# EAGLE design RHD2132_HS-accel-JAE (EAGLE 9.1.0)
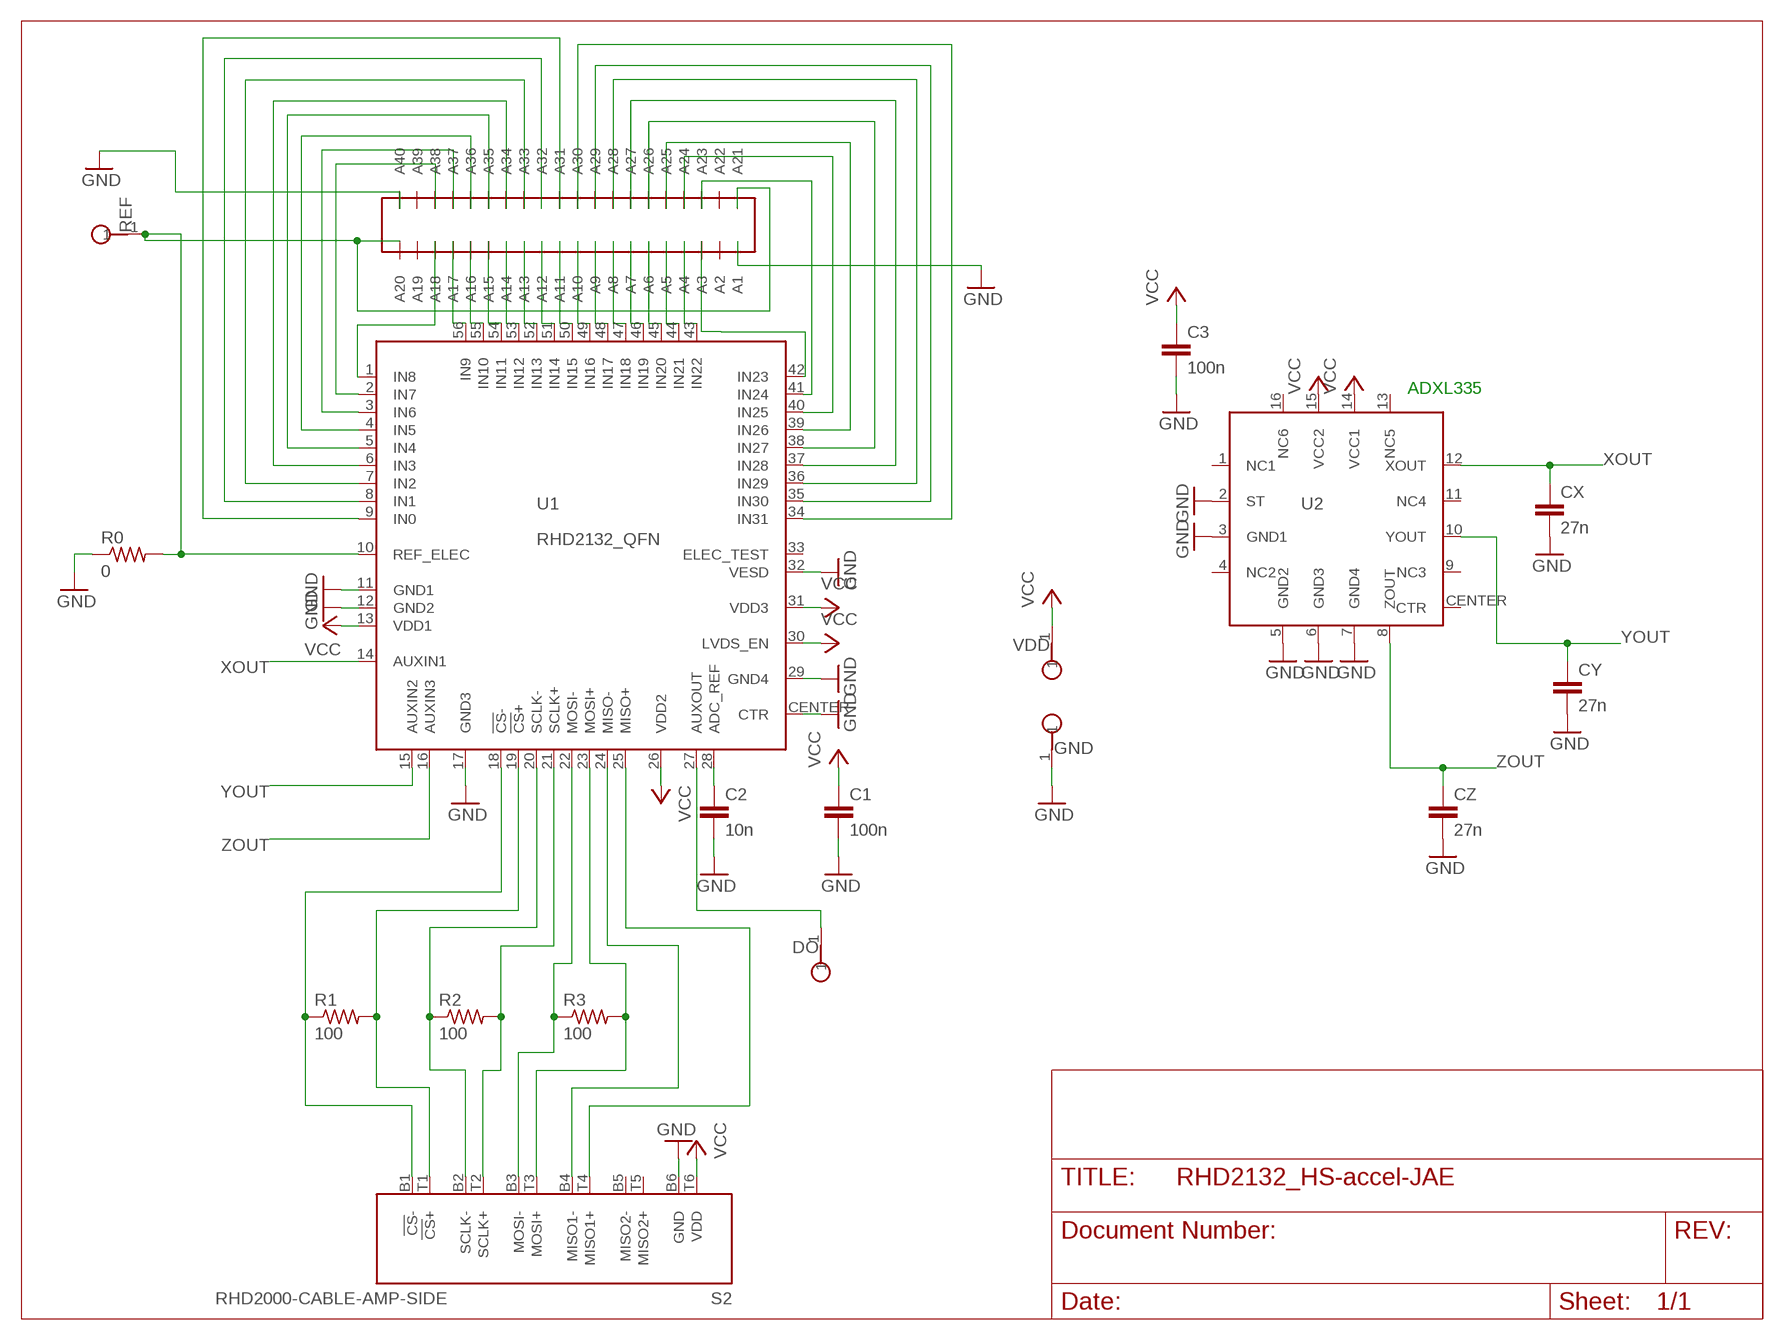
[diagram p0: schematic, sheet 1]

## Parts
C1  100n  C_0402  [0402]
C2  10n  C_0402  [0402]
C3  100n  C_0402  [0402]
CX  27n  C_0402  [0402]
CY  27n  C_0402  [0402]
CZ  27n  C_0402  [0402]
DO  TESTPOINT_SMALL  [TESTPOINT_SMALL]
GND  TESTPOINT_SMALL  [TESTPOINT_SMALL]
R0  0  R_0402  [0402]
R1  100  R_0402  [0402]
R2  100  R_0402  [0402]
R3  100  R_0402  [0402]
REF  TESTPOINT_SMALL  [TESTPOINT_SMALL]
S2  RHD2000-CABLE-AMP-SIDE  [OMNETICS_PZN-12-AA]
U1  RHD2132_QFN  [QFN56_8_X_8_LARGE]
U2  ADXL335  [ADXL335]
U$1  WR-40P-HFHD  [WR-40P-HFHD]
VDD  TESTPOINT_SMALL  [TESTPOINT_SMALL]

## Nets
GND: C1.2 C2.2 C3.2 CX.2 CY.2 CZ.2 GND.1 R0.1 S2.B6(GND) U1.11(GND1) U1.12(GND2) U1.17(GND3) U1.29(GND4) U1.32(VESD) U1.CENTER(CTR) U2.2(ST) U2.3(GND1) U2.5(GND2) U2.6(GND3) U2.7(GND4) U$1.P$1(A1) U$1.P$40(A40)
N$2: U1.3(IN6) U$1.P$37(A37)
N$3: U1.2(IN7) U$1.P$38(A38)
N$4: U1.4(IN5) U$1.P$36(A36)
N$5: U1.5(IN4) U$1.P$35(A35)
N$6: U1.6(IN3) U$1.P$34(A34)
N$7: U1.7(IN2) U$1.P$33(A33)
N$8: U1.8(IN1) U$1.P$32(A32)
N$9: U1.9(IN0) U$1.P$31(A31)
N$10: U1.34(IN31) U$1.P$30(A30)
N$11: R1.1 S2.B1(!CS!-) U1.18(!CS!-)
N$12: U1.41(IN24) U$1.P$23(A23)
N$13: U1.40(IN25) U$1.P$24(A24)
N$14: U1.39(IN26) U$1.P$25(A25)
N$15: U1.38(IN27) U$1.P$26(A26)
N$16: U1.37(IN28) U$1.P$27(A27)
N$17: U1.36(IN29) U$1.P$28(A28)
N$18: U1.35(IN30) U$1.P$29(A29)
N$19: U1.56(IN9) U$1.P$17(A17)
N$20: U1.55(IN10) U$1.P$16(A16)
N$21: U1.54(IN11) U$1.P$15(A15)
N$22: U1.53(IN12) U$1.P$14(A14)
N$23: U1.52(IN13) U$1.P$13(A13)
N$24: U1.51(IN14) U$1.P$12(A12)
N$25: U1.50(IN15) U$1.P$11(A11)
N$26: U1.49(IN16) U$1.P$10(A10)
N$27: U1.48(IN17) U$1.P$9(A9)
N$28: U1.47(IN18) U$1.P$8(A8)
N$29: U1.46(IN19) U$1.P$7(A7)
N$30: U1.45(IN20) U$1.P$6(A6)
N$31: U1.44(IN21) U$1.P$5(A5)
N$32: U1.43(IN22) U$1.P$4(A4)
N$33: U1.1(IN8) U$1.P$18(A18)
N$34: U1.42(IN23) U$1.P$3(A3)
N$35: R1.2 S2.T1(!CS!+) U1.19(!CS!+)
N$36: R2.1 S2.B2(SCLK-) U1.20(SCLK-)
N$37: R2.2 S2.T2(SCLK+) U1.21(SCLK+)
N$38: R3.1 S2.B3(MOSI-) U1.22(MOSI-)
N$39: R3.2 S2.T3(MOSI+) U1.23(MOSI+)
N$40: S2.B4(MISO1-) U1.24(MISO-)
N$41: S2.T4(MISO1+) U1.25(MISO+)
N$42: C2.1 U1.28(ADC_REF)
N$43: DO.1 U1.27(AUXOUT)
N$44: R0.2 REF.1 U1.10(REF_ELEC) U$1.P$20(A20)
VCC: C1.1 C3.1 S2.T6(VDD) U1.13(VDD1) U1.26(VDD2) U1.30(LVDS_EN) U1.31(VDD3) U2.14(VCC1) U2.15(VCC2) VDD.1
XOUT: CX.1 U1.14(AUXIN1) U2.12(XOUT)
YOUT: CY.1 U1.15(AUXIN2) U2.10(YOUT)
ZOUT: CZ.1 U1.16(AUXIN3) U2.8(ZOUT)
Unconnected: S2.B5(MISO2-) S2.T5(MISO2+) U1.33(ELEC_TEST) U2.1(NC1) U2.4(NC2) U2.9(NC3) U2.11(NC4) U2.13(NC5) U2.16(NC6) U2.CENTER(CTR) U$1.P$2(A2) U$1.P$19(A19) U$1.P$21(A21) U$1.P$22(A22) U$1.P$39(A39)

## Notes on the sheet
- ADXL335

## Library data of the parts
C1-C3 CX CY CZ = RHD2000_eval_board:C: Capacitor
DO GND REF VDD = RHD2000_eval_board:TESTPOINT: PCB Test Point
R0 R1-R3 = RHD2000_eval_board:R: Resistor
S2 = RHD2000:RHD2000-CABLE-AMP-SIDE
U1 = RHD2000:RHD2132
U2 = harrison:ADXL335
U$1 = EIBLibrary:WR-40P-HFHD

## Net classes
1 thick: width 1.016 mm
2 power: width 0.61 mm

## Board
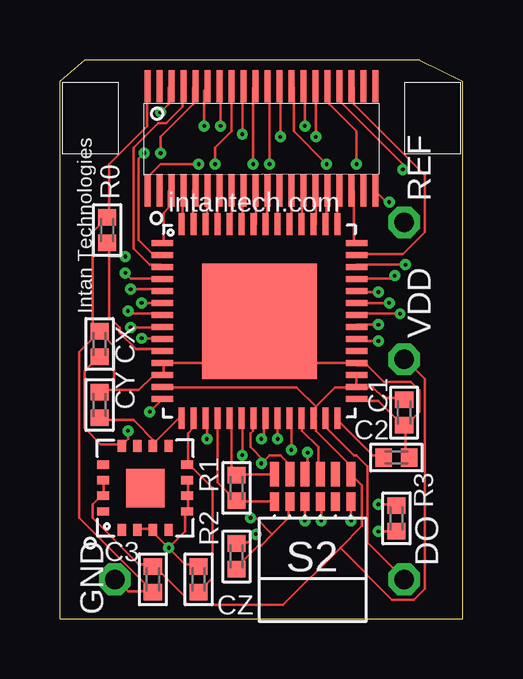
[diagram p1: board, top side]
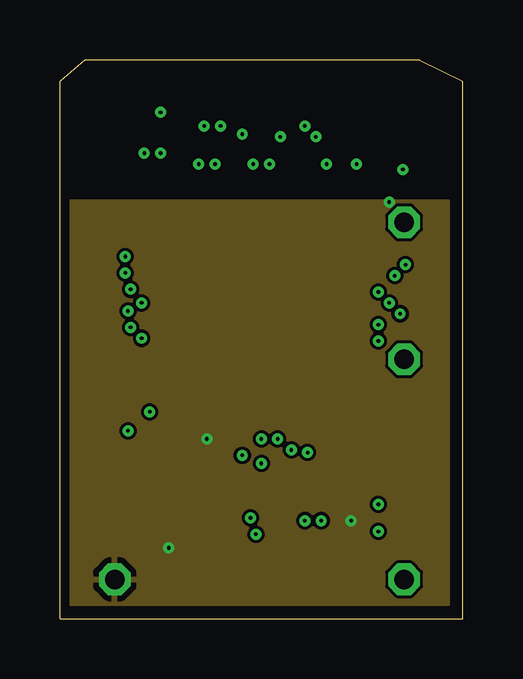
[diagram p2: board, inner layer Route2]
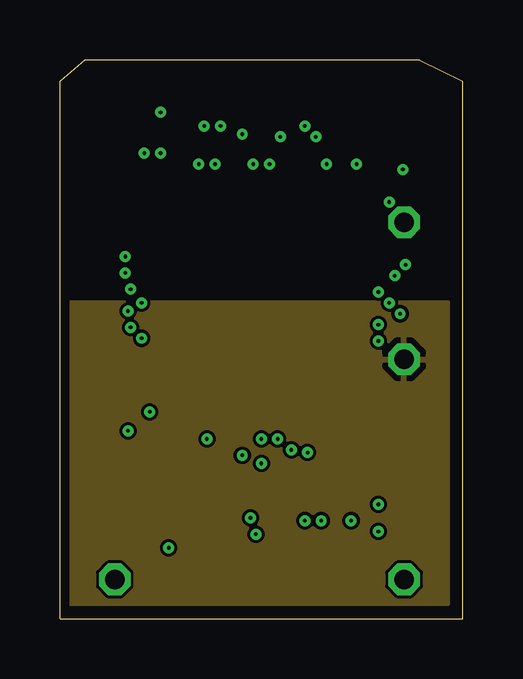
[diagram p3: board, inner layer Route15]
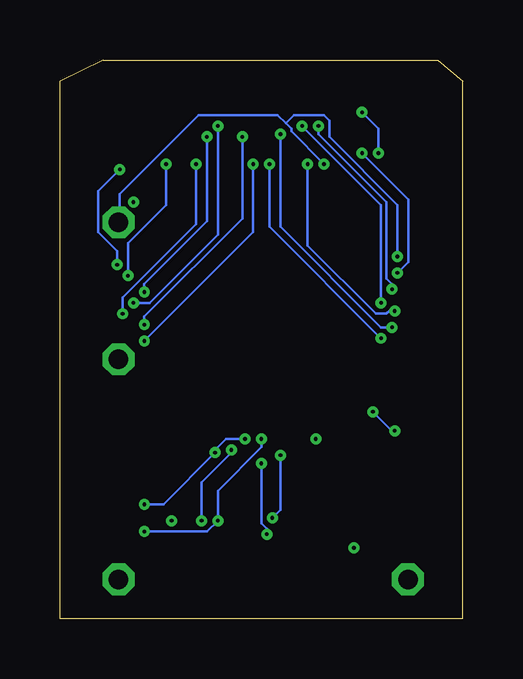
[diagram p4: board, bottom side, seen from below]

Size 16.8 x 23.3 mm. Coordinates in mm from the lower left corner, seen from the top.
Outline: 0,0 0,22.4 1.03,23.3 15.01,23.3 16.8,22.4 16.8,0 0,0
Copper layers (1*2+15*16): Top 0.035mm / dielectric 1.5mm / Route2 0.035mm / dielectric 0.15mm / Route15 0.035mm / dielectric 0.2mm / Bottom 0.035mm
Design rules "default *": minimum track width 0.1mm, minimum drill 6mil, track to track 5mil, track to pad 5mil, pad to pad 5mil, via to via 5mil, smd to smd 5mil, copper to edge 15mil, drill to drill 15mil, minimum pad ring 10mil, minimum via ring 6mil, stop-mask expansion 4mil, vias tented up to drill 0mil, thermal gap 10mil

### Footprints (pad centres in the part's own frame; a part is rotated, then mirrored left to right if it is on the bottom)
0402 = smd 0.686 x 0.762: 1 -0.533,0; 2 0.533,0
TESTPOINT_SMALL = drill 0.813 octagon: 1 0,0
OMNETICS_PZN-12-AA = smd 0.381 x 0.762: B1 1.587,-1.016; B2 0.953,-1.016; B3 0.318,-1.016; B4 -0.318,-1.016; B5 -0.953,-1.016; B6 -1.587,-1.016 | smd 0.381 x 1.016: T1 1.587,-2.159; T2 0.953,-2.159; T3 0.318,-2.159; T4 -0.318,-2.159; T5 -0.953,-2.159; T6 -1.587,-2.159
QFN56_8_X_8_LARGE = smd 0.9 x 0.25: 1 -4.05,3.25; 2 -4.05,2.75; 3 -4.05,2.25; 4 -4.05,1.75; 5 -4.05,1.25; 6 -4.05,0.75; 7 -4.05,0.25; 8 -4.05,-0.25; 9 -4.05,-0.75; 10 -4.05,-1.25; 11 -4.05,-1.75; 12 -4.05,-2.25; 13 -4.05,-2.75; 14 -4.05,-3.25; 29 4.05,-3.25; 30 4.05,-2.75; 31 4.05,-2.25; 32 4.05,-1.75; 33 4.05,-1.25; 34 4.05,-0.75; 35 4.05,-0.25; 36 4.05,0.25; 37 4.05,0.75; 38 4.05,1.25; 39 4.05,1.75; 40 4.05,2.25; 41 4.05,2.75; 42 4.05,3.25 | smd 0.25 x 0.9: 15 -3.25,-4.05; 16 -2.75,-4.05; 17 -2.25,-4.05; 18 -1.75,-4.05; 19 -1.25,-4.05; 20 -0.75,-4.05; 21 -0.25,-4.05; 22 0.25,-4.05; 23 0.75,-4.05; 24 1.25,-4.05; 25 1.75,-4.05; 26 2.25,-4.05; 27 2.75,-4.05; 28 3.25,-4.05; 43 3.25,4.05; 44 2.75,4.05; 45 2.25,4.05; 46 1.75,4.05; 47 1.25,4.05; 48 0.75,4.05; 49 0.25,4.05; 50 -0.25,4.05; 51 -0.75,4.05; 52 -1.25,4.05; 53 -1.75,4.05; 54 -2.25,4.05; 55 -2.75,4.05; 56 -3.25,4.05 | smd 4.8 x 4.8: CENTER 0,0
ADXL335 = smd 0.5 x 0.35: 1 -1.75,0.975; 2 -1.75,0.325; 3 -1.75,-0.325; 4 -1.75,-0.975; 9 1.75,-0.975; 10 1.75,-0.325; 11 1.75,0.325; 12 1.75,0.975 | smd 0.35 x 0.5: 5 -0.975,-1.75; 6 -0.325,-1.75; 7 0.325,-1.75; 8 0.975,-1.75; 13 0.975,1.75; 14 0.325,1.75; 15 -0.325,1.75; 16 -0.975,1.75 | smd 1.6 x 1.6: CENTER 0,0
WR-40P-HFHD = smd 0.25 x 1.35: P$1 0,0; P$2 0.5,0; P$3 1,0; P$4 1.5,0; P$5 2,0; P$6 2.5,0; P$7 3,0; P$8 3.5,0; P$9 4,0; P$10 4.5,0; P$11 5,0; P$12 5.5,0; P$13 6,0; P$14 6.5,0; P$15 7,0; P$16 7.5,0; P$17 8,0; P$18 8.5,0; P$19 9,0; P$20 9.5,0; P$21 0,-4.35; P$22 0.5,-4.35; P$23 1,-4.35; P$24 1.5,-4.35; P$25 2,-4.35; P$26 2.5,-4.35; P$27 3,-4.35; P$28 3.5,-4.35; P$29 4,-4.35; P$30 4.5,-4.35; P$31 5,-4.35; P$32 5.5,-4.35; P$33 6,-4.35; P$34 6.5,-4.35; P$35 7,-4.35; P$36 7.5,-4.35; P$37 8,-4.35; P$38 8.5,-4.35; P$39 9,-4.35; P$40 9.5,-4.35

### Placement (x,y rotation side)
C1  14.35,8.59 270 top
C2  14.04,6.72 0 top
C3  3.88,1.64 270 top
CX  1.65,11.45 90 top
CY  1.65,8.91 90 top
CZ  5.78,1.64 90 top
DO  14.35,1.64 0 top
GND  2.29,1.64 0 top
R0  1.97,16.2 270 top
R1  7.37,5.45 90 top
R2  7.37,2.59 90 top
R3  14.04,4.18 90 top
REF  14.35,16.53 90 top
S2  10.54,3.86 180 top
U1  8.32,12.4 0 top
U2  3.56,5.45 90 top
U$1  13.15,17.85 180 top
VDD  14.35,10.81 0 top

### Tracks (layer width: path | path; a pad name or v marks a point on that pad's centre or on a via)
GND  (via drill 0.15)
  Top 0.1: U2.7 5.33,5.67 5.33,5.22 U2.6 5.33,5.11 5.33,4.54 U2.5 5.22,4.43 5.22,3.63 v4.54,2.95 | U2.2 3.29,3.75 3.86,3.75 U2.3 3.97,3.63 3.97,3.52 v4.54,2.95 | v4.54,2.95 5.22,2.27 5.67,2.27 CZ.2 | 3.86,1.14 2.84,1.14 2.38,1.59 GND.1 | 3.86,1.14 C3.2 3.86,1.14 | v12.14,4.09 12.14,4.77 S2.B6 | v6.13,7.49 6.13,8.29 U1.17 | v13.73,17.37 13.62,17.37 13.17,17.82 U$1.P$1 | 2.27,9.53 3.29,9.53 3.86,10.1 4.2,10.1 U1.12 4.31,10.21 4.31,10.56 U1.11 4.31,10.67 6.58,10.67 8.29,12.37 U1.CENTER 8.4,12.37 10.1,10.67 12.26,10.67 U1.32 12.37,10.56 12.82,10.56 13.51,9.87 14.64,9.87 14.98,9.53 14.98,8.63 14.41,8.06 C1.2 | 2.27,9.53 1.7,9.53 CY.2 | 2.27,9.53 2.27,11.35 1.7,11.92 CX.2 | CX.2 1.59,12.03 1.36,12.26 1.36,16.12 1.93,16.68 R0.1 2.04,16.8 2.04,18.95 3.63,20.54 3.63,22.13 U$1.P$40 | C1.2 14.41,7.95 14.41,6.92 14.53,6.81 C2.2 | U1.29 12.37,9.08 13.28,9.08 14.3,8.06 C1.2 | 3.86,1.14 0.79,4.2 0.79,11.12 1.59,11.92 CX.2
  pour Route2: 0.4,0.6 16.2,0.6 16.2,17.4 0.4,17.4 0.4,12.4
N$2
  Top 0.1: U1.3 4.2,14.76 3.75,14.76 3.06,15.44 3.06,19.64 4.09,20.66 4.43,20.66 5.11,21.34 5.11,22.13 U$1.P$37
N$3  (via drill 0.15)
  Top 0.1: v3.52,19.41 3.29,19.18 3.29,15.78 3.86,15.21 4.2,15.21 U1.2 | v4.2,21.11 4.54,21.45 4.54,22.13 U$1.P$38
  Bottom 0.1: v3.52,19.41 3.52,20.43 v4.2,21.11
N$4  (via drill 0.15)
  Top 0.1: v2.72,14.41 2.95,14.19 4.2,14.19 U1.4 | v4.2,19.41 4.2,20.09 5.56,21.45 5.56,22.13 U$1.P$36
  Bottom 0.1: v2.72,14.41 2.27,14.87 2.27,17.48 v4.2,19.41
N$5  (via drill 0.15)
  Top 0.1: v2.95,13.73 4.2,13.73 U1.5 | v6.02,20.54 6.02,22.02 6.13,22.13 U$1.P$35
  Bottom 0.1: v2.95,13.73 2.95,13.96 3.18,14.19 3.18,17.37 6.02,20.2 v6.02,20.54
N$6  (via drill 0.15)
  Top 0.1: v3.4,13.17 4.2,13.17 U1.6 | v6.7,20.54 6.7,22.13 U$1.P$34
  Bottom 0.1: v3.4,13.17 3.4,17.25 v6.7,20.54
N$7  (via drill 0.15)
  Top 0.1: v2.84,12.82 2.95,12.71 4.2,12.71 U1.7 | v6.47,18.95 6.47,19.64 7.15,20.32 7.15,22.13 U$1.P$33
  Bottom 0.1: v2.84,12.82 3.06,12.82 3.18,12.71 3.63,12.71 6.47,15.55 v6.47,18.95
N$8  (via drill 0.15)
  Top 0.1: v2.95,12.14 4.2,12.14 U1.8 | v7.6,20.2 7.6,22.13 U$1.P$32
  Bottom 0.1: v2.95,12.14 3.4,12.14 7.6,16.34 v7.6,20.2
N$9  (via drill 0.15)
  Top 0.1: v3.4,11.69 4.2,11.69 U1.9 | v8.06,18.95 8.06,22.13 U$1.P$31
  Bottom 0.1: v3.4,11.69 8.06,16.34 v8.06,18.95
N$10  (via drill 0.15)
  Top 0.1: v13.28,11.58 12.37,11.58 U1.34 | v8.74,18.95 8.74,22.13 U$1.P$30
  Bottom 0.1: v13.28,11.58 8.74,16.12 v8.74,18.95
N$11
  Top 0.1: S2.B1 8.85,4.88 7.38,4.88 R1.1 7.26,4.99 6.58,5.67 6.58,8.29 U1.18
N$12
  Top 0.1: U1.41 12.37,15.21 14.3,15.21 15.21,16.12 15.21,18.5 12.26,21.45 12.26,22.13 U$1.P$23
N$13  (via drill 0.15)
  Top 0.1: v14.41,14.76 12.37,14.76 U1.40 | v14.3,18.73 14.3,18.95 11.69,21.57 11.69,22.13 U$1.P$24
  Bottom 0.1: v14.41,14.76 14.41,15.32 15.21,16.12 15.21,17.82 v14.3,18.73
N$14  (via drill 0.15)
  Top 0.1: v13.96,14.3 13.85,14.19 12.37,14.19 U1.39 | v12.37,18.95 12.37,20.32 11.24,21.45 11.24,22.13 U$1.P$25
  Bottom 0.1: v13.96,14.3 13.96,15.66 12.37,17.25 v12.37,18.95
N$15  (via drill 0.15)
  Top 0.1: v13.28,13.62 12.37,13.62 U1.38 | v10.67,20.09 10.67,22.13 U$1.P$26
  Bottom 0.1: v13.28,13.62 13.28,13.96 10.67,16.57 v10.67,20.09
N$16  (via drill 0.15)
  Top 0.1: v13.73,13.17 12.37,13.17 U1.37 | v10.21,20.54 10.21,22.13 U$1.P$27
  Bottom 0.1: v13.73,13.17 13.05,13.17 10.21,16 v10.21,20.54
N$17  (via drill 0.15)
  Top 0.1: v14.19,12.71 12.37,12.71 U1.36 | v11.12,18.95 9.76,20.32 9.76,22.13 U$1.P$28
  Bottom 0.1: v14.19,12.71 14.19,13.39 11.12,16.46 v11.12,18.95
N$18  (via drill 0.15)
  Top 0.1: v13.28,12.26 12.37,12.26 U1.35 | v9.19,20.09 9.19,22.13 U$1.P$29
  Bottom 0.1: v13.28,12.26 13.28,12.6 9.19,16.68 v9.19,20.09
N$19
  Top 0.1: U1.56 5.11,16.46 5.11,17.82 U$1.P$17
N$20
  Top 0.1: U1.55 5.56,17.82 U$1.P$16
N$21
  Top 0.1: U1.54 6.13,16.46 6.13,17.82 U$1.P$15
N$22
  Top 0.1: U1.53 6.58,16.46 6.58,17.82 U$1.P$14
N$23
  Top 0.1: U1.52 7.15,16.46 7.15,17.82 U$1.P$13
N$24
  Top 0.1: U1.51 7.6,16.46 7.6,17.82 U$1.P$12
N$25
  Top 0.1: U1.50 8.17,16.46 8.17,17.82 U$1.P$11
N$26
  Top 0.1: U1.49 8.63,16.46 8.63,17.82 U$1.P$10
N$27
  Top 0.1: U1.48 9.08,17.82 U$1.P$9
N$28
  Top 0.1: U1.47 9.65,16.46 9.65,17.82 U$1.P$8
N$29
  Top 0.1: U1.46 10.1,16.46 10.1,17.82 U$1.P$7
N$30
  Top 0.1: U1.45 10.67,16.46 10.67,17.82 U$1.P$6
N$31
  Top 0.1: U1.44 11.12,16.46 11.12,17.82 U$1.P$5
N$32
  Top 0.1: U1.43 11.58,17.82 U$1.P$4
N$33
  Top 0.1: U1.1 4.31,15.66 4.31,16.91 4.54,17.14 4.54,17.82 U$1.P$18
N$34
  Top 0.1: U1.42 12.26,15.66 12.26,17.82 U$1.P$3
N$35
  Top 0.1: S2.T1 8.85,6.02 7.38,6.02 R1.2 7.26,6.02 7.15,6.13 7.15,8.29 U1.19
N$36  (via drill 0.15)
  Top 0.1: 8.85,3.52 9.53,4.2 9.53,4.77 S2.B2 | 8.85,3.52 8.4,3.06 8.29,3.06 7.38,2.16 R2.1 | v7.6,6.81 7.6,8.29 U1.20 | v7.95,4.2 8.17,4.2 8.85,3.52
  Bottom 0.1: v7.6,6.81 7.6,4.54 v7.95,4.2
N$37  (via drill 0.15)
  Top 0.1: v8.17,3.52 7.83,3.18 7.38,3.18 R2.2 | 8.51,6.58 8.74,6.81 9.19,6.81 9.53,6.47 9.53,6.13 S2.T2 | 8.51,6.58 v8.4,6.47 8.51,6.58 | 8.51,6.58 7.95,7.15 7.95,7.72 8.06,7.83 8.06,8.29 U1.21
  Bottom 0.1: v8.17,3.52 8.17,3.75 8.4,3.97 v8.4,6.47
N$38  (via drill 0.15)
  Top 0.1: v10.21,4.09 10.21,4.77 S2.B3 | v13.28,3.63 13.96,3.63 R3.1 | v8.4,7.49 8.51,7.6 8.51,8.29 U1.22
  Bottom 0.1: v13.28,3.63 10.67,3.63 v10.21,4.09 10.21,5.33 8.4,7.15 v8.4,7.49
N$39  (via drill 0.15)
  Top 0.1: v13.28,4.77 13.96,4.77 R3.2 | v10.33,6.92 10.33,6.13 S2.T3 | v9.08,7.49 9.08,8.29 U1.23
  Bottom 0.1: v13.28,4.77 12.48,4.77 v10.33,6.92 10.33,7.04 9.87,7.49 v9.08,7.49
N$40  (via drill 0.15)
  Top 0.1: v10.9,4.09 10.9,4.77 S2.B4 | v9.65,7.04 9.65,8.29 U1.24
  Bottom 0.1: v10.9,4.09 10.9,5.67 9.65,6.92 v9.65,7.04
N$41
  Top 0.1: U1.25 10.1,8.29 10.1,7.83 10.78,7.15 10.78,6.13 S2.T4
N$42
  Top 0.1: C2.1 13.39,6.81 13.05,6.81 11.58,8.29 U1.28
N$43
  Top 0.1: U1.27 11.12,8.29 11.12,7.95 12.26,6.81 12.37,6.81 12.82,6.36 12.82,3.18 14.3,1.7 DO.1
N$44  (via drill 0.15)
  Top 0.1: 2.04,15.1 2.04,12.6 2.5,12.14 2.5,11.92 3.18,11.24 4.2,11.24 U1.10 | 2.04,15.1 2.04,15.66 R0.2 | v5.79,18.95 4.2,18.95 3.75,18.5 3.75,17.93 U$1.P$20 | v2.72,15.1 2.04,15.1
  Bottom 0.1: v5.79,18.95 7.15,20.32 7.15,20.43 7.38,20.66 | 7.38,20.66 7.72,21 11.01,21 14.3,17.71 14.3,16.57 REF.1 | v2.72,15.1 2.72,17.25 5.56,20.09 5.56,20.77 5.79,21 7.04,21 7.38,20.66
VCC
  Top 0.1: U2.14 1.82,5.67 1.82,5.22 U2.15 1.7,5.11 1.36,4.77 1.36,4.2 3.29,2.27 3.86,2.27 C3.1 3.97,2.16 5.22,0.91 5.22,0.68 5.33,0.57 9.31,0.57 11.69,2.95 | C1.1 14.3,9.19 13.51,9.19 13.05,9.65 U1.30 | 10.67,8.85 10.67,8.4 U1.26 10.67,8.29 10.67,7.83 12.03,6.47 12.03,6.13 S2.T6 12.14,6.02 12.6,5.56 12.6,3.86 11.69,2.95 | 10.67,8.85 11.46,9.65 12.26,9.65 U1.30 | 10.67,8.85 9.87,9.65 4.31,9.65 U1.13 | U1.31 12.37,10.1 12.37,9.76 U1.30 | 11.69,2.95 13.85,0.79 14.76,0.79 15.21,1.25 15.21,9.99 14.41,10.78 VDD.1
  pour Route15: 0.4,0.6 16.2,0.6 16.2,13.2 16,13.2 0.4,13.2
XOUT  (via drill 0.15)
  Top 0.1: CX.1 1.59,10.9 1.02,10.33 1.02,7.95 1.7,7.26 2.5,7.26 U2.12 2.61,7.26 2.84,7.49 v2.84,7.83 | v3.75,8.63 4.2,9.08 U1.14
  Bottom 0.1: v3.75,8.63 2.95,7.83 v2.84,7.83
YOUT
  Top 0.1: 3.97,7.38 3.97,7.26 U2.10 3.97,7.38 | 3.97,7.38 4.99,8.4 U1.15 | 3.97,7.38 3.06,8.29 1.7,8.29 CY.1
ZOUT
  Top 0.1: 5.33,6.47 5.33,7.72 5.56,7.95 5.56,8.29 U1.16 | 5.33,6.47 U2.8 5.33,6.47 | 5.33,6.47 6.36,5.45 6.36,1.7 5.79,1.14 CZ.1

### Text on the board
tPlace: intantech.com | Intan Technologies